# Altium schematic sheet H-00488 - Ethernet Switch.SchDoc: 8-Port Ethernet Switch (KSZ8999)
size 403 x 281 mm; DocumentNumber: 6; SheetNumber: 6; SheetTotal: 12
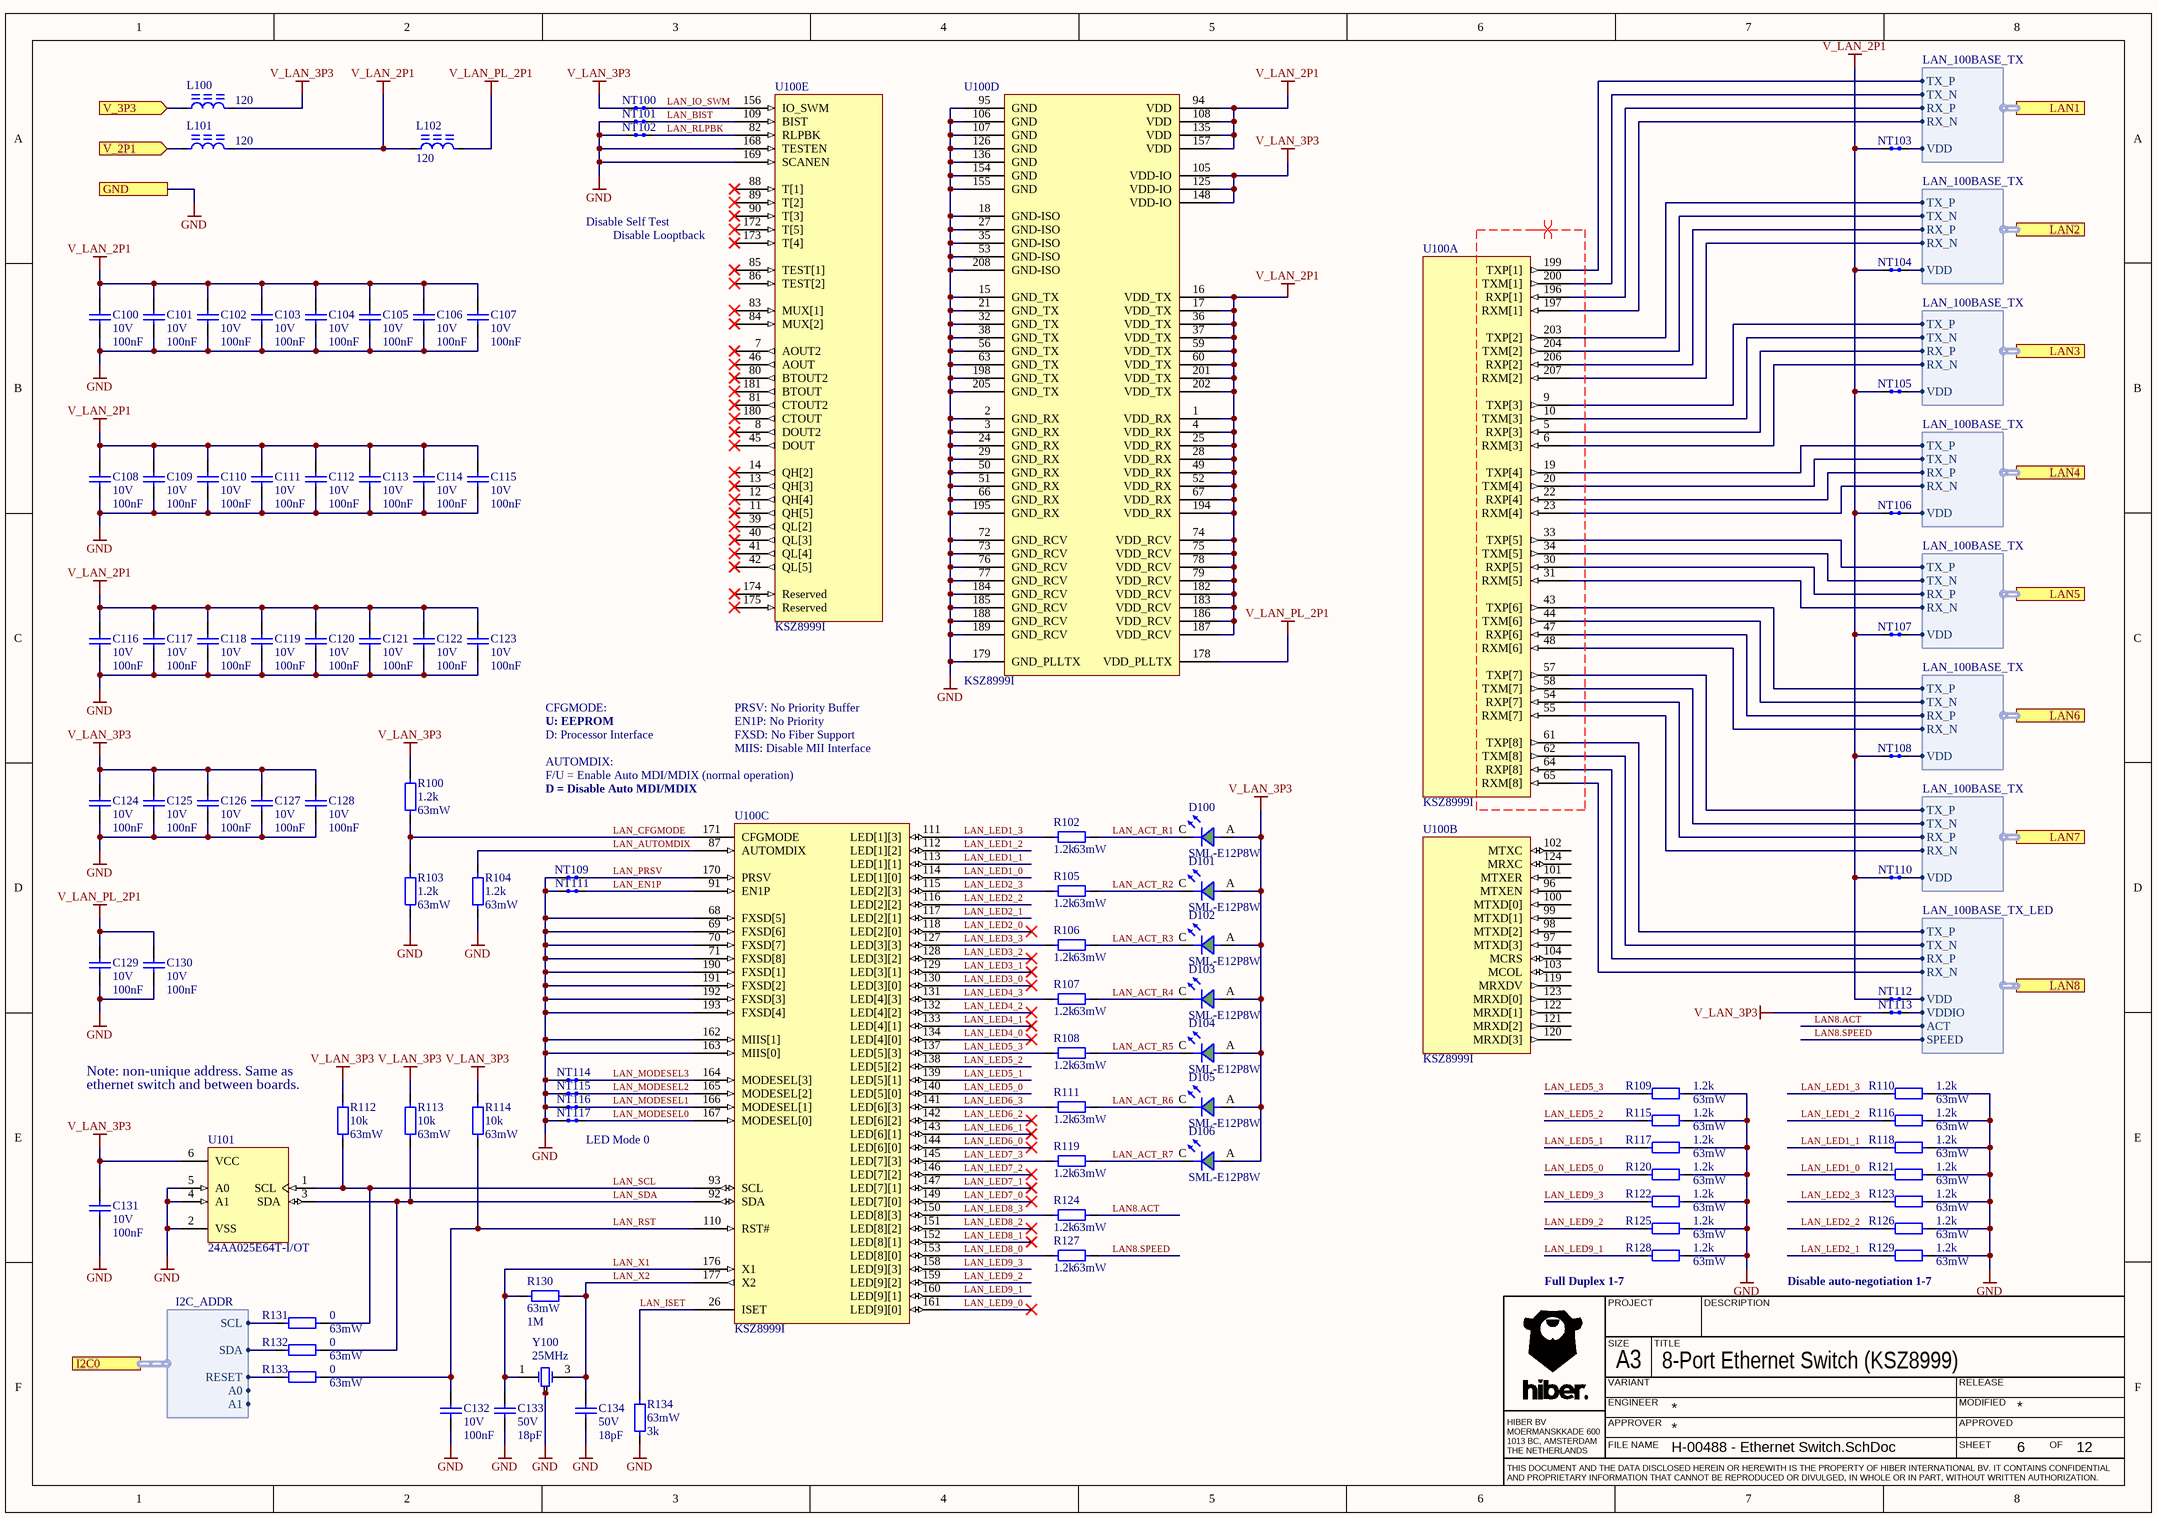
[diagram p0: H-00488 - Ethernet Switch.SchDoc]

## Parts
C100  value 100nF  Rated Voltage: 10V  [CAPC100X50X55L30N]  (hidden comment: C0402C104K8RACTU)
C101  value 100nF  Rated Voltage: 10V  [CAPC100X50X55L30N]  (hidden comment: C0402C104K8RACTU)
C102  value 100nF  Rated Voltage: 10V  [CAPC100X50X55L30N]  (hidden comment: C0402C104K8RACTU)
C103  value 100nF  Rated Voltage: 10V  [CAPC100X50X55L30N]  (hidden comment: C0402C104K8RACTU)
C104  value 100nF  Rated Voltage: 10V  [CAPC100X50X55L30N]  (hidden comment: C0402C104K8RACTU)
C105  value 100nF  Rated Voltage: 10V  [CAPC100X50X55L30N]  (hidden comment: C0402C104K8RACTU)
C106  value 100nF  Rated Voltage: 10V  [CAPC100X50X55L30N]  (hidden comment: C0402C104K8RACTU)
C107  value 100nF  Rated Voltage: 10V  [CAPC100X50X55L30N]  (hidden comment: C0402C104K8RACTU)
C108  value 100nF  Rated Voltage: 10V  [CAPC100X50X55L30N]  (hidden comment: C0402C104K8RACTU)
C109  value 100nF  Rated Voltage: 10V  [CAPC100X50X55L30N]  (hidden comment: C0402C104K8RACTU)
C110  value 100nF  Rated Voltage: 10V  [CAPC100X50X55L30N]  (hidden comment: C0402C104K8RACTU)
C111  value 100nF  Rated Voltage: 10V  [CAPC100X50X55L30N]  (hidden comment: C0402C104K8RACTU)
C112  value 100nF  Rated Voltage: 10V  [CAPC100X50X55L30N]  (hidden comment: C0402C104K8RACTU)
C113  value 100nF  Rated Voltage: 10V  [CAPC100X50X55L30N]  (hidden comment: C0402C104K8RACTU)
C114  value 100nF  Rated Voltage: 10V  [CAPC100X50X55L30N]  (hidden comment: C0402C104K8RACTU)
C115  value 100nF  Rated Voltage: 10V  [CAPC100X50X55L30N]  (hidden comment: C0402C104K8RACTU)
C116  value 100nF  Rated Voltage: 10V  [CAPC100X50X55L30N]  (hidden comment: C0402C104K8RACTU)
C117  value 100nF  Rated Voltage: 10V  [CAPC100X50X55L30N]  (hidden comment: C0402C104K8RACTU)
C118  value 100nF  Rated Voltage: 10V  [CAPC100X50X55L30N]  (hidden comment: C0402C104K8RACTU)
C119  value 100nF  Rated Voltage: 10V  [CAPC100X50X55L30N]  (hidden comment: C0402C104K8RACTU)
C120  value 100nF  Rated Voltage: 10V  [CAPC100X50X55L30N]  (hidden comment: C0402C104K8RACTU)
C121  value 100nF  Rated Voltage: 10V  [CAPC100X50X55L30N]  (hidden comment: C0402C104K8RACTU)
C122  value 100nF  Rated Voltage: 10V  [CAPC100X50X55L30N]  (hidden comment: C0402C104K8RACTU)
C123  value 100nF  Rated Voltage: 10V  [CAPC100X50X55L30N]  (hidden comment: C0402C104K8RACTU)
C124  value 100nF  Rated Voltage: 10V  [CAPC100X50X55L30N]  (hidden comment: C0402C104K8RACTU)
C125  value 100nF  Rated Voltage: 10V  [CAPC100X50X55L30N]  (hidden comment: C0402C104K8RACTU)
C126  value 100nF  Rated Voltage: 10V  [CAPC100X50X55L30N]  (hidden comment: C0402C104K8RACTU)
C127  value 100nF  Rated Voltage: 10V  [CAPC100X50X55L30N]  (hidden comment: C0402C104K8RACTU)
C128  value 100nF  Rated Voltage: 10V  [CAPC100X50X55L30N]  (hidden comment: C0402C104K8RACTU)
C129  value 100nF  Rated Voltage: 10V  [CAPC100X50X55L30N]  (hidden comment: C0402C104K8RACTU)
C130  value 100nF  Rated Voltage: 10V  [CAPC100X50X55L30N]  (hidden comment: C0402C104K8RACTU)
C131  value 100nF  Rated Voltage: 10V  [CAPC100X50X55L30N]  (hidden comment: C0402C104K8RACTU)
C132  value 100nF  Rated Voltage: 10V  [CAPC100X50X55L30N]  (hidden comment: C0402C104K8RACTU)
C133  value 18pF  Rated Voltage: 50V  [CAPC100X50X55L30N]  (hidden comment: C0402C180J5GACTU)
C134  value 18pF  Rated Voltage: 50V  [CAPC100X50X55L30N]  (hidden comment: C0402C180J5GACTU)
D100  SML-E12P8W  [LEDC170X80X80L20_GREEN]
D101  SML-E12P8W  [LEDC170X80X80L20_GREEN]
D102  SML-E12P8W  [LEDC170X80X80L20_GREEN]
D103  SML-E12P8W  [LEDC170X80X80L20_GREEN]
D104  SML-E12P8W  [LEDC170X80X80L20_GREEN]
D105  SML-E12P8W  [LEDC170X80X80L20_GREEN]
D106  SML-E12P8W  [LEDC170X80X80L20_GREEN]
L100  Impedance: 120  [BEADC160X80X95L30]  (hidden comment: BLM18PG121SN1D)
L101  Impedance: 120  [BEADC160X80X95L30]  (hidden comment: BLM18PG121SN1D)
L102  Impedance: 120  [BEADC160X80X95L30]  (hidden comment: BLM18PG121SN1D)
NT100  NET-TIE  [NT200]  (value not drawn)  (net tie, no BOM)
NT101  NET-TIE  [NT200]  (value not drawn)  (net tie, no BOM)
NT102  NET-TIE  [NT200]  (value not drawn)  (net tie, no BOM)
NT103  NET-TIE  [NT200]  (value not drawn)  (net tie, no BOM)
NT104  NET-TIE  [NT200]  (value not drawn)  (net tie, no BOM)
NT105  NET-TIE  [NT200]  (value not drawn)  (net tie, no BOM)
NT106  NET-TIE  [NT200]  (value not drawn)  (net tie, no BOM)
NT107  NET-TIE  [NT200]  (value not drawn)  (net tie, no BOM)
NT108  NET-TIE  [NT200]  (value not drawn)  (net tie, no BOM)
NT109  NET-TIE  [NT200]  (value not drawn)  (net tie, no BOM)
NT110  NET-TIE  [NT200]  (value not drawn)  (net tie, no BOM)
NT111  NET-TIE  [NT200]  (value not drawn)  (net tie, no BOM)
NT112  NET-TIE  [NT200]  (value not drawn)  (net tie, no BOM)
NT113  NET-TIE  [NT200]  (value not drawn)  (net tie, no BOM)
NT114  NET-TIE  [NT200]  (value not drawn)  (net tie, no BOM)
NT115  NET-TIE  [NT200]  (value not drawn)  (net tie, no BOM)
NT116  NET-TIE  [NT200]  (value not drawn)  (net tie, no BOM)
NT117  NET-TIE  [NT200]  (value not drawn)  (net tie, no BOM)
R100  value 1.2k  Rated Power: 63mW  [RESC100X50X40L25N]  (hidden comment: CRCW04021K20FKED)
R102  value 1.2k  Rated Power: 63mW  [RESC100X50X40L25N]  (hidden comment: CRCW04021K20FKED)
R103  value 1.2k  Rated Power: 63mW  [RESC100X50X40L25N]  (hidden comment: CRCW04021K20FKED)
R104  value 1.2k  Rated Power: 63mW  [RESC100X50X40L25N]  (hidden comment: CRCW04021K20FKED)
R105  value 1.2k  Rated Power: 63mW  [RESC100X50X40L25N]  (hidden comment: CRCW04021K20FKED)
R106  value 1.2k  Rated Power: 63mW  [RESC100X50X40L25N]  (hidden comment: CRCW04021K20FKED)
R107  value 1.2k  Rated Power: 63mW  [RESC100X50X40L25N]  (hidden comment: CRCW04021K20FKED)
R108  value 1.2k  Rated Power: 63mW  [RESC100X50X40L25N]  (hidden comment: CRCW04021K20FKED)
R109  value 1.2k  Rated Power: 63mW  [RESC100X50X40L25N]  (hidden comment: CRCW04021K20FKED)
R110  value 1.2k  Rated Power: 63mW  [RESC100X50X40L25N]  (hidden comment: CRCW04021K20FKED)
R111  value 1.2k  Rated Power: 63mW  [RESC100X50X40L25N]  (hidden comment: CRCW04021K20FKED)
R112  value 10k  Rated Power: 63mW  [RESC100X50X40L25N]  (hidden comment: CRCW040210K0FKED)
R113  value 10k  Rated Power: 63mW  [RESC100X50X40L25N]  (hidden comment: CRCW040210K0FKED)
R114  value 10k  Rated Power: 63mW  [RESC100X50X40L25N]  (hidden comment: CRCW040210K0FKED)
R115  value 1.2k  Rated Power: 63mW  [RESC100X50X40L25N]  (hidden comment: CRCW04021K20FKED)
R116  value 1.2k  Rated Power: 63mW  [RESC100X50X40L25N]  (hidden comment: CRCW04021K20FKED)
R117  value 1.2k  Rated Power: 63mW  [RESC100X50X40L25N]  (hidden comment: CRCW04021K20FKED)
R118  value 1.2k  Rated Power: 63mW  [RESC100X50X40L25N]  (hidden comment: CRCW04021K20FKED)
R119  value 1.2k  Rated Power: 63mW  [RESC100X50X40L25N]  (hidden comment: CRCW04021K20FKED)
R120  value 1.2k  Rated Power: 63mW  [RESC100X50X40L25N]  (hidden comment: CRCW04021K20FKED)
R121  value 1.2k  Rated Power: 63mW  [RESC100X50X40L25N]  (hidden comment: CRCW04021K20FKED)
R122  value 1.2k  Rated Power: 63mW  [RESC100X50X40L25N]  (hidden comment: CRCW04021K20FKED)
R123  value 1.2k  Rated Power: 63mW  [RESC100X50X40L25N]  (hidden comment: CRCW04021K20FKED)
R124  value 1.2k  Rated Power: 63mW  [RESC100X50X40L25N]  (hidden comment: CRCW04021K20FKED)
R125  value 1.2k  Rated Power: 63mW  [RESC100X50X40L25N]  (hidden comment: CRCW04021K20FKED)
R126  value 1.2k  Rated Power: 63mW  [RESC100X50X40L25N]  (hidden comment: CRCW04021K20FKED)
R127  value 1.2k  Rated Power: 63mW  [RESC100X50X40L25N]  (hidden comment: CRCW04021K20FKED)
R128  value 1.2k  Rated Power: 63mW  [RESC100X50X40L25N]  (hidden comment: CRCW04021K20FKED)
R129  value 1.2k  Rated Power: 63mW  [RESC100X50X40L25N]  (hidden comment: CRCW04021K20FKED)
R130  value 1M  Rated Power: 63mW  [RESC100X50X40L25N]  (hidden comment: CRCW04021M00FKED)
R131  value 0  Rated Power: 63mW  [RESC100X50X40L25N]  (hidden comment: CRCW04020000Z0ED)
R132  value 0  Rated Power: 63mW  [RESC100X50X40L25N]  (hidden comment: CRCW04020000Z0ED)
R133  value 0  Rated Power: 63mW  [RESC100X50X40L25N]  (hidden comment: CRCW04020000Z0ED)
R134  value 3k  Rated Power: 63mW  [RESC100X50X40L25N]  (hidden comment: CRCW04023K00FKED)
U100  KSZ8999I  [QFP208P50_3120X3120X410L88X22N]  (parts A,B,C,D,E of 5)
U101  24AA025E64T-I/OT  [SOT23-6P95_270X145L35X35]
Y100  Frequency: 25MHz  [OSCCC320X250X60L90X110]  (hidden comment: TSX-3225 25.0000MF10P-C0)

## Ports
GND, I2C0 (harness I2C_ADDR), LAN1 (harness LAN_100BASE_TX), LAN2 (harness LAN_100BASE_TX), LAN3 (harness LAN_100BASE_TX), LAN4 (harness LAN_100BASE_TX), LAN5 (harness LAN_100BASE_TX), LAN6 (harness LAN_100BASE_TX), LAN7 (harness LAN_100BASE_TX), LAN8 (harness LAN_100BASE_TX_LED), V_2P1 (in), V_3P3 (in)

## Harnesses
LAN_100BASE_TX: RX_N, RX_P, TX_P, TX_N, VDD
LAN_100BASE_TX_LED: RX_N, RX_P, TX_P, TX_N, ACT, SPEED, VDDIO, VDD
I2C_ADDR: SDA, SCL, A0, A1, RESET

## Nets
GND: C100.2 C101.2 C102.2 C103.2 C104.2 C105.2 C106.2 C107.2 C108.2 C109.2 C110.2 C111.2 C112.2 C113.2 C114.2 C115.2 C116.2 C117.2 C118.2 C119.2 C120.2 C121.2 C122.2 C123.2 C124.2 C125.2 C126.2 C127.2 C128.2 C129.2 C130.2 C131.2 C132.2 C133.2 C134.2 NT101.1 NT102.1 NT109.1 NT111.1 NT114.1 NT115.1 NT116.1 NT117.1 R103.1 R104.1 R109.2 R110.2 R115.2 R116.2 R117.2 R118.2 R120.2 R121.2 R122.2 R123.2 R125.2 R126.2 R128.2 R129.2 R134.1 U100.2(GND_RX) U100.3(GND_RX) U100.15(GND_TX) U100.18(GND-ISO) U100.21(GND_TX) U100.24(GND_RX) U100.27(GND-ISO) U100.29(GND_RX) U100.32(GND_TX) U100.35(GND-ISO) U100.38(GND_TX) U100.50(GND_RX) U100.51(GND_RX) U100.53(GND-ISO) U100.56(GND_TX) U100.63(GND_TX) U100.66(GND_RX) U100.68(FXSD[5]) U100.69(FXSD[6]) U100.70(FXSD[7]) U100.71(FXSD[8]) U100.72(GND_RCV) U100.73(GND_RCV) U100.76(GND_RCV) U100.77(GND_RCV) U100.95(GND) U100.106(GND) U100.107(GND) U100.126(GND) U100.136(GND) U100.154(GND) U100.155(GND) U100.162(MIIS[1]) U100.163(MIIS[0]) U100.168(TESTEN) U100.169(SCANEN) U100.179(GND_PLLTX) U100.184(GND_RCV) U100.185(GND_RCV) U100.188(GND_RCV) U100.189(GND_RCV) U100.190(FXSD[1]) U100.191(FXSD[2]) U100.192(FXSD[3]) U100.193(FXSD[4]) U100.195(GND_RX) U100.198(GND_TX) U100.205(GND_TX) U100.208(GND-ISO) U101.2(VSS) U101.4(A1) U101.5(A0) Y100.2 Y100.4 ; port GND
V_LAN_2P1: C100.1 C101.1 C102.1 C103.1 C104.1 C105.1 C106.1 C107.1 C108.1 C109.1 C110.1 C111.1 C112.1 C113.1 C114.1 C115.1 C116.1 C117.1 C118.1 C119.1 C120.1 C121.1 C122.1 C123.1 L101.2 L102.1 NT103.1 NT104.1 NT105.1 NT106.1 NT107.1 NT108.1 NT110.1 NT112.1 U100.1(VDD_RX) U100.4(VDD_RX) U100.16(VDD_TX) U100.17(VDD_TX) U100.25(VDD_RX) U100.28(VDD_RX) U100.36(VDD_TX) U100.37(VDD_TX) U100.49(VDD_RX) U100.52(VDD_RX) U100.59(VDD_TX) U100.60(VDD_TX) U100.67(VDD_RX) U100.74(VDD_RCV) U100.75(VDD_RCV) U100.78(VDD_RCV) U100.79(VDD_RCV) U100.94(VDD) U100.108(VDD) U100.135(VDD) U100.157(VDD) U100.182(VDD_RCV) U100.183(VDD_RCV) U100.186(VDD_RCV) U100.187(VDD_RCV) U100.194(VDD_RX) U100.201(VDD_TX) U100.202(VDD_TX)
V_LAN_3P3: C124.1 C125.1 C126.1 C127.1 C128.1 C131.1 D100.A D101.A D102.A D103.A D104.A D105.A D106.A L100.2 NT100.1 NT113.1 R100.1 R112.1 R113.1 R114.1 U100.105(VDD-IO) U100.125(VDD-IO) U100.148(VDD-IO) U101.6(VCC)
V_LAN_PL_2P1: C129.1 C130.1 L102.2 U100.178(VDD_PLLTX)
LAN8.ACT: R124.1 ; port LAN8.ACT
LAN8.SPEED: R127.1 ; port LAN8.SPEED
LAN_ACT_R1: D100.C R102.1
LAN_ACT_R2: D101.C R105.1
LAN_ACT_R3: D102.C R106.1
LAN_ACT_R4: D103.C R107.1
LAN_ACT_R5: D104.C R108.1
LAN_ACT_R6: D105.C R111.1
LAN_ACT_R7: D106.C R119.1
LAN_AUTOMDIX: R104.2 U100.87(AUTOMDIX)
LAN_BIST: NT101.2 U100.109(BIST)
LAN_CFGMODE: R100.2 R103.2 U100.171(CFGMODE)
LAN_EN1P: NT111.2 U100.91(EN1P)
LAN_IO_SWM: NT100.2 U100.156(IO_SWM)
LAN_ISET: R134.2 U100.26(ISET)
LAN_LED1_0: R121.1 U100.114(LED[1][0])
LAN_LED1_1: R118.1 U100.113(LED[1][1])
LAN_LED1_2: R116.1 U100.112(LED[1][2])
LAN_LED1_3: R102.2 R110.1 U100.111(LED[1][3])
LAN_LED2_0: U100.118(LED[2][0])
LAN_LED2_1: R129.1 U100.117(LED[2][1])
LAN_LED2_2: R126.1 U100.116(LED[2][2])
LAN_LED2_3: R105.2 R123.1 U100.115(LED[2][3])
LAN_LED3_0: U100.130(LED[3][0])
LAN_LED3_1: U100.129(LED[3][1])
LAN_LED3_2: U100.128(LED[3][2])
LAN_LED3_3: R106.2 U100.127(LED[3][3])
LAN_LED4_0: U100.134(LED[4][0])
LAN_LED4_1: U100.133(LED[4][1])
LAN_LED4_2: U100.132(LED[4][2])
LAN_LED4_3: R107.2 U100.131(LED[4][3])
LAN_LED5_0: R120.1 U100.140(LED[5][0])
LAN_LED5_1: R117.1 U100.139(LED[5][1])
LAN_LED5_2: R115.1 U100.138(LED[5][2])
LAN_LED5_3: R108.2 R109.1 U100.137(LED[5][3])
LAN_LED6_0: U100.144(LED[6][0])
LAN_LED6_1: U100.143(LED[6][1])
LAN_LED6_2: U100.142(LED[6][2])
LAN_LED6_3: R111.2 U100.141(LED[6][3])
LAN_LED7_0: U100.149(LED[7][0])
LAN_LED7_1: U100.147(LED[7][1])
LAN_LED7_2: U100.146(LED[7][2])
LAN_LED7_3: R119.2 U100.145(LED[7][3])
LAN_LED8_0: R127.2 U100.153(LED[8][0])
LAN_LED8_1: U100.152(LED[8][1])
LAN_LED8_2: U100.151(LED[8][2])
LAN_LED8_3: R124.2 U100.150(LED[8][3])
LAN_LED9_0: U100.161(LED[9][0])
LAN_LED9_1: R128.1 U100.160(LED[9][1])
LAN_LED9_2: R125.1 U100.159(LED[9][2])
LAN_LED9_3: R122.1 U100.158(LED[9][3])
LAN_MODESEL0: NT117.2 U100.167(MODESEL[0])
LAN_MODESEL1: NT116.2 U100.166(MODESEL[1])
LAN_MODESEL2: NT115.2 U100.165(MODESEL[2])
LAN_MODESEL3: NT114.2 U100.164(MODESEL[3])
LAN_PRSV: NT109.2 U100.170(PRSV)
LAN_RLPBK: NT102.2 U100.82(RLPBK)
LAN_RST: C132.1 R114.2 R133.2 U100.110(RST#)
LAN_SCL: R112.2 R131.1 U100.93(SCL) U101.1(SCL)
LAN_SDA: R113.2 R132.1 U100.92(SDA) U101.3(SDA)
LAN_X1: C133.1 R130.1 U100.176(X1) Y100.1
LAN_X2: C134.1 R130.2 U100.177(X2) Y100.3
V_2P1: L101.1 ; port V_2P1
V_3P3: L100.1 ; port V_3P3
NetNT103_2: NT103.2 ; port LAN1.VDD
NetNT104_2: NT104.2 ; port LAN2.VDD
NetNT105_2: NT105.2 ; port LAN3.VDD
NetNT106_2: NT106.2 ; port LAN4.VDD
NetNT107_2: NT107.2 ; port LAN5.VDD
NetNT108_2: NT108.2 ; port LAN6.VDD
NetNT110_2: NT110.2 ; port LAN7.VDD
NetNT112_2: NT112.2 ; port LAN8.VDD
NetNT113_2: NT113.2 ; port LAN8.VDDIO
NetR131_2: R131.2 ; port I2C0.SCL
NetR132_2: R132.2 ; port I2C0.SDA
NetR133_1: R133.1 ; port I2C0.RESET
NetU100_5: U100.5(RXP[3]) ; port LAN3.RX_P
NetU100_6: U100.6(RXM[3]) ; port LAN3.RX_N
NetU100_9: U100.9(TXP[3]) ; port LAN3.TX_P
NetU100_10: U100.10(TXM[3]) ; port LAN3.TX_N
NetU100_19: U100.19(TXP[4]) ; port LAN4.TX_P
NetU100_20: U100.20(TXM[4]) ; port LAN4.TX_N
NetU100_22: U100.22(RXP[4]) ; port LAN4.RX_P
NetU100_23: U100.23(RXM[4]) ; port LAN4.RX_N
NetU100_30: U100.30(RXP[5]) ; port LAN5.RX_P
NetU100_31: U100.31(RXM[5]) ; port LAN5.RX_N
NetU100_33: U100.33(TXP[5]) ; port LAN5.TX_P
NetU100_34: U100.34(TXM[5]) ; port LAN5.TX_N
NetU100_43: U100.43(TXP[6]) ; port LAN6.TX_P
NetU100_44: U100.44(TXM[6]) ; port LAN6.TX_N
NetU100_47: U100.47(RXP[6]) ; port LAN6.RX_P
NetU100_48: U100.48(RXM[6]) ; port LAN6.RX_N
NetU100_54: U100.54(RXP[7]) ; port LAN7.RX_P
NetU100_55: U100.55(RXM[7]) ; port LAN7.RX_N
NetU100_57: U100.57(TXP[7]) ; port LAN7.TX_P
NetU100_58: U100.58(TXM[7]) ; port LAN7.TX_N
NetU100_61: U100.61(TXP[8]) ; port LAN8.TX_P
NetU100_62: U100.62(TXM[8]) ; port LAN8.TX_N
NetU100_64: U100.64(RXP[8]) ; port LAN8.RX_P
NetU100_65: U100.65(RXM[8]) ; port LAN8.RX_N
NetU100_196: U100.196(RXP[1]) ; port LAN1.RX_P
NetU100_197: U100.197(RXM[1]) ; port LAN1.RX_N
NetU100_199: U100.199(TXP[1]) ; port LAN1.TX_P
NetU100_200: U100.200(TXM[1]) ; port LAN1.TX_N
NetU100_203: U100.203(TXP[2]) ; port LAN2.TX_P
NetU100_204: U100.204(TXM[2]) ; port LAN2.TX_N
NetU100_206: U100.206(RXP[2]) ; port LAN2.RX_P
NetU100_207: U100.207(RXM[2]) ; port LAN2.RX_N

Not connected (* = marked no-connect by the designer): U100 7(AOUT2)* 8(DOUT2)* 11(QH[5])* 12(QH[4])* 13(QH[3])* 14(QH[2])* 39(QL[2])* 40(QL[3])* 41(QL[4])* 42(QL[5])* 45(DOUT)* 46(AOUT)* 80(BTOUT2)* 81(CTOUT2)* 83(MUX[1])* 84(MUX[2])* 85(TEST[1])* 86(TEST[2])* 88(T[1])* 89(T[2])* 90(T[3])* 96(MTXEN) 97(MTXD[3]) 98(MTXD[2]) 99(MTXD[1]) 100(MTXD[0]) 101(MTXER) 102(MTXC) 103(MCOL) 104(MCRS) 119(MRXDV) 120(MRXD[3]) 121(MRXD[2]) 122(MRXD[1]) 123(MRXD[0]) 124(MRXC) 172(T[5])* 173(T[4])* 174(Reserved)* 175(Reserved)* 180(CTOUT)* 181(BTOUT)*

## Layout directives
differential pair; differential pair class DIFF_LAN: (no net found under the mark)

## Notes on the sheet
- Disable Self Test
- Disable Looptback
- CFGMODE:
- U: EEPROM
- PRSV: No Priority Buffer
- EN1P: No Priority
- D: Processor Interface
- AUTOMDIX:
- F/U = Enable Auto MDI/MDIX (normal operation)
- D = Disable Auto MDI/MDIX
- MIIS: Disable MII Interface
- FXSD: No Fiber Support
- (near R112) Note: non-unique address. Same as
- (near R112) ethernet switch and between boards.
- LED Mode 0
- (near R128) Full Duplex 1-7
- (near R129) Disable auto-negotiation 1-7
- PROJECT
- DESCRIPTION
- SIZE
- ENGINEER
- VARIANT
- A3
- TITLE
- MODIFIED
- RELEASE
- HIBER BV
  MOERMANSKKADE 600
  1013 BC, AMSTERDAM
  THE NETHERLANDS
- FILE NAME
- APPROVER
- SHEET
- APPROVED
- OF
- THIS DOCUMENT AND THE DATA DISCLOSED HEREIN OR HEREWITH IS THE PROPERTY OF HIBER INTERNATIONAL BV. IT CONTAINS CONFIDENTIAL AND PROPRIETARY INFORMATION THAT CANNOT BE REPRODUCED OR DIVULGED, IN WHOLE OR IN PART, WITHOUT WRITTEN AUTHORIZATION.

## Library data of the parts
C100-C132 = CMP-00367-3: CAP Standard 0402 (1005) 100,0nF 10V X7R (Standard); Type: Ceramic; Tolerance: 10%; Termination Finish: 100% Matte Sn; Qualification: Standard; RoHS: Yes; Mount: SMT; Case/Package: 0402 (1005); Failure Rate: N/A; Pins: 2; Dielectric: X7R
C133 C134 = CMP-00401-3: CAP Standard 0402 (1005) 18,0pF 50V C0G (Standard); Type: Ceramic; Tolerance: 5%; Termination Finish: 100% Matte Sn; Qualification: Standard; RoHS: Yes; Mount: SMD; Case/Package: 0402 (1005); Failure Rate: N/A; Pins: 2; Dielectric: C0G
D100-D106 = CMP-00431-1: LED Green Diffused 0603 SMD; Dominant Wavelength: 630nm; Viewing Angle: 140°; Test Current: 20mA; Forward Voltage: 2,5V; Typical Wavelength: 560nm; Number of LEDs: 1; Lens Style: Clear, Colorless, Diffused, Rectangular; Luminous Intensity: 6.3mcd; Chip Structure: AlGaInP; Illumination Colour: Red; Lens Colour: White; Package Quantity: 1; Max Operating Temperature: 85°C; Width: 0.8mm; Case Code (Imperial): 0603; Length: 1.6mm; Lens Transparency: Diffused; Lead Free: Lead Free; Number of Pins: 2; Mount: Surface Mount; Height: 0.46mm; Color: Green; Case/Package: 0603; Forward Current: 20mA; Radiation Hardening: No; Min Operating Temperature: -40°C; Wavelength: 630nm; Case Code (Metric): 1608; Packaging: Tape and Reel
L100-L102 = CMP-00417-3: IND, Automotive, Chip Ferrite Bead, Power Lines, 0603, 120R, 2A; Maximum DC Resistance: 50m; Tolerance: 25%; Case/Package: 0603 (1608); Qualification: Automotive; Rated Current: 2A; Termination Finish: Tin
NT100-NT117 = CMP-00523-9: Net Tie, Inline
R100 R102-R111 R115-R129 = CMP-00272-8: RES Standard Thick Film 0402 1K20 ±1% 0,063W; Qualification: Automotive; Rated Voltage: 50V; Case/Package: 0402 (1005); Pins: 2; RoHS: Yes; Mount: Surface Mount; Tolerance: 1%; Termination Finish: Pure tin solder contacts on Ni barrier layer; Failure Rate: N/A; Type: Standard Thick Film
R112-R114 = CMP-00294-7: RES Standard Thick Film 0402 10K0 ±1% 0,063W; Qualification: Automotive; Rated Voltage: 50V; Case/Package: 0402 (1005); Pins: 2; RoHS: Yes; Mount: Surface Mount; Tolerance: 1%; Termination Finish: Pure tin solder contacts on Ni barrier layer; Failure Rate: N/A; Type: Standard Thick Film
R130 = CMP-00342-7: RES Standard Thick Film 0402 1M00 ±1% 0,063W; Rated Voltage: 50V; Qualification: Automotive; Pins: 2; Mount: Surface Mount; Tolerance: 1%; Case/Package: 0402 (1005); Termination Finish: Pure tin solder contacts on Ni barrier layer; Failure Rate: N/A; RoHS: Yes; Type: Standard Thick Film
R131-R133 = CMP-00197-9: RES Standard Thick Film 0402 0R00 ±1% 0,063W; Qualification: Automotive; Rated Voltage: 50V; Case/Package: 0402 (1005); Tolerance: 1%; Pins: 2; Termination Finish: Pure tin solder contacts on Ni barrier layer; Failure Rate: N/A; RoHS: Yes; Type: Standard Thick Film; Mount: Surface Mount
R134 = CMP-00281-8: RES Standard Thick Film 0402 3K00 ±1% 0,063W; Rated Voltage: 50V; Qualification: Automotive; Failure Rate: N/A; Case/Package: 0402 (1005); Type: Standard Thick Film; RoHS: Yes; Tolerance: 1%; Termination Finish: Pure tin solder contacts on Ni barrier layer; Pins: 2; Mount: Surface Mount
U100 = CMP-01072-7: LAN Switching Circuit, PQFP208; Time @ Peak Reflow Temperature-Max (s): 40s; Package Body Material: Plastic; Supply Voltage-Nom: 2.1V; Number of Functions: 1; Qualification Status: Not Qualified; Max Operating Temperature: 85°C; Terminal Pitch: 0.5mm; Package Style: FLATPACK, FINE PITCHMeter; Surface Mount: Yes; Moisture Sensitivity Level: 3; Min Operating Temperature: -40°C; JESD-609 Code: e3; Telecom IC Type: LAN SWITCHING CIRCUIT; Length: 28mm; Height - Seated (Max): 3.8mm; JESD-30 Code: S-PQFP-G208; Number of Pins: 208; Peak Reflow Temperature (Cel): 260°C; Package Code: FQFP; Package Shape: Square; Terminal Position: QUAD; Terminal Form: Gull Wing; Terminal Finish: Tin; Temperature Grade: INDUSTRIAL; Width: 28mm
U101 = CMP-01106-2: EEPROM, 256X8, Serial, CMOS, PDSO5; Time @ Peak Reflow Temperature-Max (s): 40s; Serial Bus Type: I2C; Terminal Finish: Tin; Peak Reflow Temperature (Cel): 260°C; Memory Type: EEPROM; Moisture Sensitivity Level: 1; JESD-609 Code: e3
Y100 = CMP-01105-3: Crystal 25MHz ±10ppm (Tol) ±10ppm (Stability) 18pF FUND 40Ohm 4-Pin SMD T/R; Frequency Stability: 0.0018%; Series Resistance: 40R; Qualification: Standard; Crystal/Resonator Type: PARALLEL - FUNDAMENTAL; Operating Frequency-Nom: 250; Aging: 1 PPM/FIRST YEAR; Drive Level: 1uW; Additional Feature: TAPE AND REEL; Pins: 2; Case/Package: SMD/SMT; Frequency Tolerance: 10ppm; Max Operating Temperature: 85°C; Min Operating Temperature: -40°C; Mount: Surface Mount; RoHS: Yes; Terminal Finish: Nickel; JESD-609 Code: e4